# Altium project WB55_board.PrjPcb (part 1 of 3)
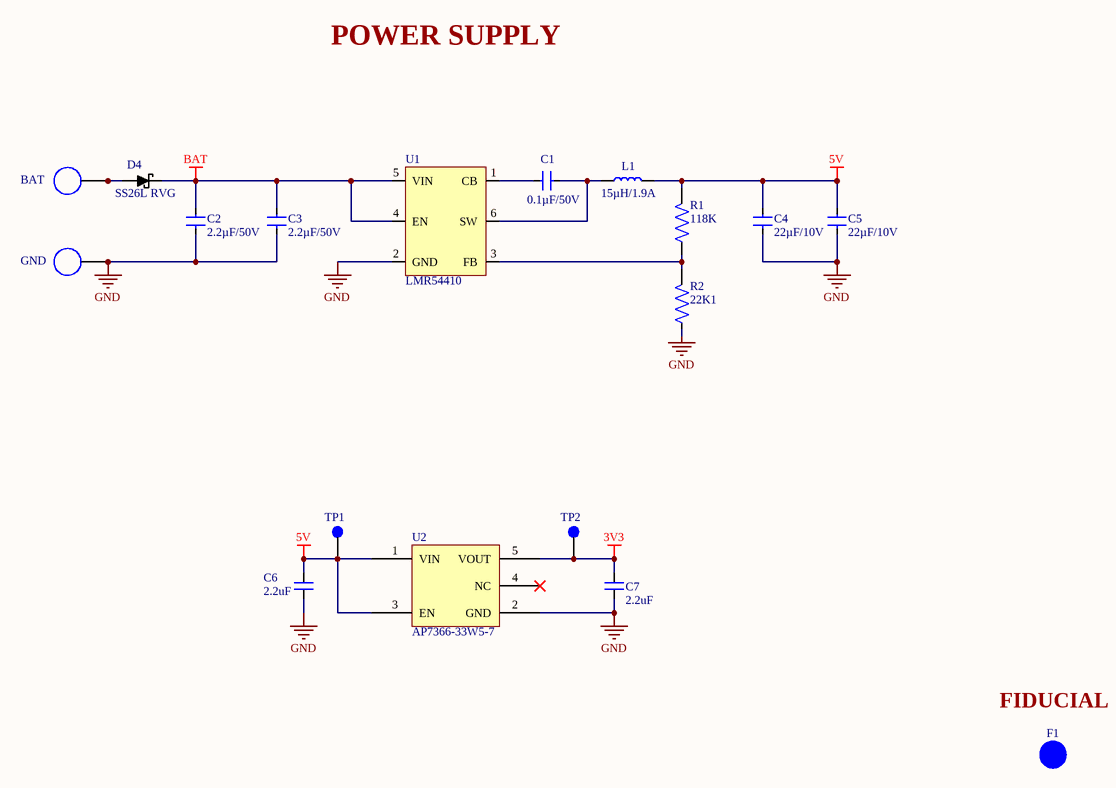
[diagram p0: PowerSupply.SchDoc]
3 sheets, 79 parts. Net scope: flat (ports and power ports of the same name join across sheets).
Board file: PCB1.PcbDoc
Sheets:
  PowerSupply.SchDoc
  MCU.SchDoc
  MCU_IO.SchDoc

## Sheet PowerSupply.SchDoc
size A4; SheetNumber: 1; SheetTotal: 3

### Parts
BAT  Terminal  [2.5mmHOLE]  (value not drawn)  (no BOM)
C1  0.1µF/50V  [C0402]
C2  2.2µF/50V  [C0603]
C3  2.2µF/50V  [C0603]
C4  22µF/10V  [C0603]
C5  22µF/10V  [C0603]
C6  value 2.2uF  [C0603]  (hidden comment: C0603C225K4PACTU)
C7  value 2.2uF  [C0603]  (hidden comment: C0603C225K4PACTU)
D4  SS26L RVG  [SS26LRVG]
F1  FIDUCIAL  [FID_40x120]  (value not drawn)  (no BOM)
GND  Terminal  [2.5mmHOLE]  (value not drawn)  (no BOM)
L1  15µH/1.9A  [SRN6045-150M]
R1  value 118K  [R0402]  (hidden comment: RC0402FR-07118KL)
R2  value 22K1  [R0402]  (hidden comment: RC0402FR-0722K1L)
TP1  TP  [TP]  (value not drawn)  (no BOM)
TP2  TP  [TP]  (value not drawn)  (no BOM)
U1  LMR54410  [LMR54410]
U2  AP7366-33W5-7  [SOT25]

### Nets
3V3: C7.2 TP2.1 U2.5(VOUT)
5V: C4.2 C5.2 C6.2 L1.2 R1.2 TP1.1 U2.1(VIN) U2.3(EN)
BAT: C2.2 C3.2 D4.1(Cathode) U1.4(EN) U1.5(VIN)
GND: C2.1 C3.1 C4.1 C5.1 C6.1 C7.1 GND.1 R2.1 U1.2(GND) U2.2(GND)
NetBAT_1: BAT.1 D4.2(Anode)
NetC1_1: C1.1 U1.1(CB)
NetC1_2: C1.2 L1.1 U1.6(SW)
NetR1_1: R1.1 R2.2 U1.3(FB)

Not connected (* = marked no-connect by the designer): F1 1; U2 4(NC)*

### Notes on the sheet
- POWER SUPPLY
- (near F1) FIDUCIAL

### Library data of the parts
C1 = GRM155R71H104KE14J: MLCC - 0.1µF 50V  0402 X7R ±10%; Manufacturer 1: Murata; Capacitance: 100nF; .PCBChecked: Alex Batista; Supplier 1: Digi-Key; Manufacturer Part Number 1: GRM155R71H104KE14J; Stock 1: 715500; Pricing 1: 1=0.10000, 10=0.03300, 50=0.01780, 100=0.01460, 500=0.01040, 1000=0.00817, 2500=0.00742, 5000=0.00683 (USD); RoHS: Yes; Mount: Surface Mount; Case/Package: 0402; Case Code (Imperial): 0402; Weight: 0.000212oz; Case Code (Metric): 1005; Min Operating Temperature: -55°C; Max Operating Temperature: 125°C; Tolerance: 10%; Dielectric: X7R; Termination: SMD/SMT; Resistor Type: Ceramic; Voltage Rating (DC): 50V; Package Quantity: 50000; Packaging: Tape and Reel; Voltage Rating: 50V; Length: 0.039inch; Width: 0.5mm; Height: 0.5mm; Thickness: 0.022inch; Lead Free: Lead Free; ComponentLink1URL: http://search.murata.co.jp/Ceramy/image/img/A01X/G101/ENG/GRM155R71H104KE14-01.pdf?src-supplier=Mouser; ComponentLink1Description: http://search.murata.co.jp/Ceramy/image/img/A01X/G101/ENG/GRM155R71H104KE14-01.pdf?src-supplier=Mouser; ComponentLink2URL: http://search.murata.co.jp/Ceramy/image/img/A01X/G101/ENG/GRM155R71H104KE14-01.pdf?src-supplier=Avnet; ComponentLink2Description: http://search.murata.co.jp/Ceramy/image/img/A01X/G101/ENG/GRM155R71H104KE14-01.pdf?src-supplier=Avnet; ComponentLink3URL: http://search.murata.co.jp/Ceramy/image/img/A01X/G101/ENG/GRM155R71H104KE14-01.pdf?src-supplier=Digi-Key; ComponentLink3Description: http://search.murata.co.jp/Ceramy/image/img/A01X/G101/ENG/GRM155R71H104KE14-01.pdf?src-supplier=Digi-Key; ComponentLink4URL: http://search.murata.co.jp/Ceramy/image/img/A01X/G101/ENG/GRM155R71H104KE14-01.pdf?src-supplier=Avnet+Europe; ComponentLink4Description: http://search.murata.co.jp/Ceramy/image/img/A01X/G101/ENG/GRM155R71H104KE14-01.pdf?src-supplier=Avnet+Europe; Supplier Part Number 1: 490-13342-1-ND; .SCHChecked: Alex Batista; Manufacturer: Murata; Manufacturer Part Number: GRM155R71H104KE14J
C2 C3 = GRT188R61H225KE13D: MLCC - 2.2µF 50V  0603 X5R ±10%; Manufacturer 1: Murata; Material: 4241ConductorMaterial; Value: 2.2uF; Dielectric: 1537DielectricType; .SCHChecked: Alex Batista; .Mounting: SMT; Supplier: Digikey; Supplier Part Number: 490-12332-1-ND; Manufacturer Part Number 1: GRT188R61H225KE13D; RoHS: Yes; Category: Ceramic Capacitors; Stock: 50026; Pricing: 1=0.19, 10=0.125, 50=0.0788, 100=0.063, 500=0.04552, 1000=0.04027 (USD); Mounting Technology: Surface Mount; Case/Package: 0603; Case Code (Metric): 1608; Case Code (Imperial): 0603; Min Operating Temperature: -55°C; Max Operating Temperature: 85°C; Packaging: Cut Tape; Voltage Rating: 50V; Tolerance: 10%; Series: GRT; Voltage Rating (DC): 50V; Length: 0.063inch; Width: 0.031inch; Height: 1mm; Thickness: 0.035inch; Ratings: AEC-Q200; RoHS Compliant: Yes; ComponentLink1URL: http://www.farnell.com/datasheets/2165960.pdf?src-supplier=Farnell; ComponentLink1Description: http://www.farnell.com/datasheets/2165960.pdf?src-supplier=Farnell; ComponentLink2URL: https://datasheet.octopart.com/GRT188R61H225KE13D-Murata-datasheet-149523597.pdf?src-supplier=Farnell; ComponentLink2Description: https://datasheet.octopart.com/GRT188R61H225KE13D-Murata-datasheet-149523597.pdf?src-supplier=Farnell; ComponentLink3URL: https://datasheet.octopart.com/GRT188R61H225KE13D-Murata-datasheet-67697752.pdf?src-supplier=Element14; ComponentLink3Description: https://datasheet.octopart.com/GRT188R61H225KE13D-Murata-datasheet-67697752.pdf?src-supplier=Element14; ComponentLink4URL: https://search.murata.co.jp/Ceramy/image/img/A01X/G101/ENG/GRT188R61H225KE13-01.pdf?src-supplier=Digikey; ComponentLink4Description: https://search.murata.co.jp/Ceramy/image/img/A01X/G101/ENG/GRT188R61H225KE13-01.pdf?src-supplier=Digikey; ComponentLink5URL: http://search.murata.co.jp/Ceramy/image/img/A01X/G101/ENG/GRT188R61H225KE13-01.pdf?src-supplier=Digikey; ComponentLink5Description: http://search.murata.co.jp/Ceramy/image/img/A01X/G101/ENG/GRT188R61H225KE13-01.pdf?src-supplier=Digikey; ComponentLink6URL: https://datasheet.octopart.com/GRT188R61H225KE13D-Murata-datasheet-165579666.pdf?src-supplier=TME; ComponentLink6Description: https://datasheet.octopart.com/GRT188R61H225KE13D-Murata-datasheet-165579666.pdf?src-supplier=TME; .PCBChecked: Alex Batista; Manufacturer: Murata; Manufacturer Part Number: GRT188R61H225KE13D
C4 C5 = CL10A226MP8NUNE: MLCC - 22µF 10V 0603 X5R ±20%; Manufacturer 1: Samsung; Dielectric Material: Ceramic; Value: 22uF; Multilayer: Yes; .SCHChecked: Alex Batista; .Mounting: SMT; Supplier 1: Digikey; Manufacturer Part Number 1: CL10A226MP8NUNE; RoHS: Yes; Category: Ceramic Capacitors; Stock 1: 4041118; Pricing 1: 1=0,13, 10=0,074, 100=0,0471, 1000=0,03264 (USD); Mounting Technology: Surface Mount; Pins: 2; Package Shape: Rectangular; Case/Package: 0603; Terminal Finish: Nickel; Min Operating Temperature: -55°C; Max Operating Temperature: 85°C; JESD-609 Code: e3; Capacitor Type: Ceramic; Tolerance  (fill in as +-): 20%; Package Style: SMTMeter; Packaging: Tape and Reel; Tolerance (fill in as +-): 20%; Rated DC Voltage (URdc): 10V; Temperature Characteristics Code: X5R; Termination: Wraparound; Length: 1.6mm; Width: 0.8mm; Height: 1.05mm; Reach SVHC Compliant: Yes; RoHS Compliant: Yes; ComponentLink1URL: https://datasheet.ciiva.com:443/pdfs/VipMasterIC/IC/SEMS/SEMS-S-A0008525088/SEMS-S-A0008525102-1.pdf?src-supplier=IHS+Markit; ComponentLink1Description: https://datasheet.ciiva.com:443/pdfs/VipMasterIC/IC/SEMS/SEMS-S-A0008525088/SEMS-S-A0008525102-1.pdf?src-supplier=IHS+Markit; ComponentLink2URL: https://datasheet.ciiva.com/25711/cl10a226mp8nune-25711532.pdf?src-supplier=Digikey; ComponentLink2Description: https://datasheet.ciiva.com/25711/cl10a226mp8nune-25711532.pdf?src-supplier=Digikey; ComponentLink3URL: https://datasheet.ciiva.com/26838/getdatasheetpartid-746477-26838370.pdf?src-supplier=Verical; ComponentLink3Description: https://datasheet.ciiva.com/26838/getdatasheetpartid-746477-26838370.pdf?src-supplier=Verical; Supplier Part Number 1: 1276-1274-1-ND; .PCBChecked: Alex Batista; Manufacturer: Samsung; Manufacturer Part Number: CL10A226MP8NUNE
C6 C7 = C0603C225K4PACTU: Ceramic Capacitor, Multilayer, Ceramic, 16V, 10% +Tol, 10% -Tol, X5R, 15% TC, 2.2uF, Surface Mount, 0603; Manufacturer: KEMET; Dissipation Factor: 5%; Supplier: Mouser; Supplier Part Number: 80-C0603C225K4P; Manufacturer Part Number: C0603C225K4PACTU; RoHS: Yes; Category: Ceramic Capacitors; Stock: 124238; Pricing: 1=0,12, 10=0,059, 50=0,059, 100=0,039, 1000=0,027, 10000=0,017 (USD); Mounting Technology: Surface Mount; Case/Package: 0603; Pins: 2; Case Code (Imperial): 0603; Case Code (Metric): 1608; Dielectric Material: Ceramic; Material: Ceramic; Min Operating Temperature: -55°C; Max Operating Temperature: 85°C; Tolerance: 10%; Voltage Rating: 16V; Voltage Rating (DC): 16V; Packaging: Tape and Reel; Package Quantity: 1; Dielectric: X5R; Termination: SMD/SMT; Voltage: 16V; Series: C; Construction: Flat; Length: 1.6mm; Width: 0.031inch; Height: 0.8mm; Thickness: 0.034inch; Depth: 0.8mm; Radiation Hardening: No; Reach SVHC Compliant: No; RoHS Compliant: Yes; Lead Free: 5697LeadFree; ComponentLink1URL: https://datasheet.ciiva.com/5969/1776083-5969304.pdf?src-supplier=Farnell; ComponentLink1Description: https://datasheet.ciiva.com/5969/1776083-5969304.pdf?src-supplier=Farnell; ComponentLink2URL: https://datasheet.ciiva.com/7823/1776083-7823706.pdf?src-supplier=Element14; ComponentLink2Description: https://datasheet.ciiva.com/7823/1776083-7823706.pdf?src-supplier=Element14
D4 = SS26L RVG: DIODE - Schottky 60V 2A 2-Pin Sub SMA T/R; Manufacturer 1: Taiwan Semiconductor; .SCHChecked: Alex Batista; .Mouting: SMT; Supplier: Digi-Key; Supplier Part Number: SS26LRVGCT-ND; Manufacturer Part Number 1: SS26L RVG; RoHS: Yes; Stock: 38; Pricing: 1=0.66, 10=0.578 (USD); RoHS Compliant: Yes; .PCBChecked: Alex Batista; Manufacturer: Taiwan Semiconductor; Manufacturer Part Number: SS26L RVG
L1 = SRN6045-150M: IND - 15µH Semi-Shielded 1.9 A 95.8mOhm; Manufacturer 1: Bourns; Core Material: Ferrite; Inductance Tolerance: 20%; Current Rating: 1.9A; Saturation Current: 2.3A; Value: 15uH; DC Resistance (DCR): 95.8mR; Self Resonant Frequency: 13MHz; Test Frequency: 100kHz; .SCHChecked: Alex Batista; .Mouting: SMT; Supplier: Digi-Key; Supplier Part Number: SRN6045-150MCT-ND; Manufacturer Part Number 1: SRN6045-150M; RoHS: Yes; Category: Fixed Inductors; Stock: 65513; Pricing: 1=0.57, 10=0.499, 25=0.464, 50=0.3924, 100=0.3568, 250=0.33536, 500=0.2997 (USD); Mounting Technology: Surface Mount; Case/Package: Nonstandard; Pins: 2; Weight: 0.027725oz; Min Operating Temperature: -40°C; Max Operating Temperature: 125°C; Tolerance: 20%; Packaging: Tape and Reel; Shielding: Shielded; Package Quantity: 1000; Max DC Current: 1.9A; Termination: SMD/SMT; RMS Current (Irms): 1.9A; Series: SRN6045; Length: 6mm; Width: 6mm; Height: 4.5mm; Height - Seated (Max): 0.177inch; Depth: 6mm; Reach SVHC Compliant: No; RoHS Compliant: Yes; ComponentLink1URL: https://datasheet.ciiva.com/5986/1705518-5986195.pdf?src-supplier=Farnell; ComponentLink1Description: https://datasheet.ciiva.com/5986/1705518-5986195.pdf?src-supplier=Farnell; ComponentLink2URL: https://datasheet.ciiva.com/11802/0900766b80fe1f3e-11802573.pdf?src-supplier=Rs; ComponentLink2Description: https://datasheet.ciiva.com/11802/0900766b80fe1f3e-11802573.pdf?src-supplier=Rs; ComponentLink3URL: https://datasheet.ciiva.com/4954/srn6045-70649-4954231.pdf?src-supplier=Mouser; ComponentLink3Description: https://datasheet.ciiva.com/4954/srn6045-70649-4954231.pdf?src-supplier=Mouser; ComponentLink4URL: https://datasheet.ciiva.com/8512/srn6045-8512989.pdf?src-supplier=Avnet; ComponentLink4Description: https://datasheet.ciiva.com/8512/srn6045-8512989.pdf?src-supplier=Avnet; ComponentLink5URL: https://datasheet.ciiva.com/1056/srn6045-1056106.pdf?src-supplier=Digi-Key; ComponentLink5Description: https://datasheet.ciiva.com/1056/srn6045-1056106.pdf?src-supplier=Digi-Key; ComponentLink6URL: https://datasheet.ciiva.com/1056/srn6045-1056107.pdf?src-supplier=Digi-Key; ComponentLink6Description: https://datasheet.ciiva.com/1056/srn6045-1056107.pdf?src-supplier=Digi-Key; ComponentLink7URL: https://datasheet.ciiva.com/1056/srn6045-1056108.pdf?src-supplier=Digi-Key; ComponentLink7Description: https://datasheet.ciiva.com/1056/srn6045-1056108.pdf?src-supplier=Digi-Key; ComponentLink8URL: https://datasheet.ciiva.com/17113/70231653-17113165.pdf?src-supplier=Allied+Electronics; ComponentLink8Description: https://datasheet.ciiva.com/17113/70231653-17113165.pdf?src-supplier=Allied+Electronics; .PCBChecked: Alex Batista; Manufacturer: Bourns; Manufacturer Part Number: SRN6045-150M
R1 = RC0402FR-07118KL: RES - 118K 1/16W 0402 ±1%; Manufacturer 1: Yageo; Power Rating: 62.5mW; Voltage Rating: 50V; Temperature Coefficient: 100ppm/°C; Max Power Dissipation: 63mW; .SCHChecked: Alex Batista; .Mouting: SMT; Supplier: Digi-Key; Supplier Part Number: YAG2369CT-ND; Manufacturer Part Number 1: RC0402FR-07118KL; RoHS: Yes; Category: Chip SMD Resistors; Stock: 556112; Pricing: 1=0.1, 10=0.014, 50=0.0084, 100=0.007, 500=0.00464, 1000=0.00396, 5000=0.00282 (USD); Case/Package: 0402; Case Code (Metric): 1005; Case Code (Imperial): 0402; Contact Plating: Tin,Matte; Min Operating Temperature: -55°C; Max Operating Temperature: 155°C; Tolerance: 1%; Packaging: Tape and Reel; Package Quantity: 10000; Number of Terminations: 2; Termination: SMD/SMT; Voltage Rating (DC): 50V; Features: Moisture Resistant; Series: RC; Construction: Rectangular; Length: 1mm; Width: 0.5mm; Height: 0.016inch; Depth: 0.5mm; Military Standard: Not; Lead Free: Lead Free; RoHS Compliant: Yes; ComponentLink1URL: https://datasheet.ciiva.com/8887/pyu-rc0402-51-rohs-l-6-8887658.pdf?src-supplier=Avnet; ComponentLink1Description: https://datasheet.ciiva.com/8887/pyu-rc0402-51-rohs-l-6-8887658.pdf?src-supplier=Avnet; ComponentLink2URL: https://datasheet.ciiva.com/12558/pyu-rc0402-51-rohs-l-6-r-8721-12558524.pdf?src-supplier=Mouser; ComponentLink2Description: https://datasheet.ciiva.com/12558/pyu-rc0402-51-rohs-l-6-r-8721-12558524.pdf?src-supplier=Mouser; ComponentLink3URL: https://datasheet.ciiva.com/2552/pyu-r-int-thick-7-2552967.pdf?src-supplier=Digi-Key; ComponentLink3Description: https://datasheet.ciiva.com/2552/pyu-r-int-thick-7-2552967.pdf?src-supplier=Digi-Key; ComponentLink4URL: https://datasheet.ciiva.com/26829/getdatasheetpartid-702380-26829882.pdf?src-supplier=Verical; ComponentLink4Description: https://datasheet.ciiva.com/26829/getdatasheetpartid-702380-26829882.pdf?src-supplier=Verical; .PCBChecked: Alex Batista; Manufacturer: Yageo; Manufacturer Part Number: RC0402FR-07118KL
R2 = RC0402FR-0722K1L: RES - 22K1 1/16W 0402 ±1%; Manufacturer 1: Yageo; Power Rating: 62.5mW; Voltage Rating: 50V; Max Power Dissipation: 63mW; Temperature Coefficient: 100ppm/°C; .PCBChecked: Alex Batista; .Mouting: SMT; Supplier: Digi-Key; Supplier Part Number: 311-22.1KLRCT-ND; Manufacturer Part Number 1: RC0402FR-0722K1L; RoHS: Yes; Category: Chip SMD Resistors; Stock: 435944; Pricing: 1=0.1, 10=0.014, 50=0.0084, 100=0.007, 500=0.00464, 1000=0.00396, 5000=0.00282 (USD); Case/Package: 0402; Case Code (Metric): 1005; Case Code (Imperial): 0402; Min Operating Temperature: -55°C; Max Operating Temperature: 155°C; Package Quantity: 1; Tolerance: 1%; Packaging: Tape and Reel; Resistor Type: Thick Film; Number of Terminations: 2; Termination: SMD/SMT; Voltage Rating (DC): 50V; Working Voltage: 50V; Features: Moisture Resistant; Series: RC; Technology: THICK FILM; Resistance Tolerance: 1%; Construction: Rectangular; Length: 0.039inch; Width: 0.02inch; Height: 0.016inch; Depth: 0.5mm; Reach SVHC Compliant: No; Military Standard: Not; Lead Free: Lead Free; RoHS Compliant: Yes; ComponentLink1URL: https://datasheet.ciiva.com/2553/pyu-r-int-thick-7-2553200.pdf?src-supplier=Digi-Key; ComponentLink1Description: https://datasheet.ciiva.com/2553/pyu-r-int-thick-7-2553200.pdf?src-supplier=Digi-Key; ComponentLink2URL: https://datasheet.ciiva.com/2553/pyu-r-int-thick-7-2553201.pdf?src-supplier=Digi-Key; ComponentLink2Description: https://datasheet.ciiva.com/2553/pyu-r-int-thick-7-2553201.pdf?src-supplier=Digi-Key; ComponentLink3URL: https://datasheet.ciiva.com/2553/pyu-r-int-thick-7-2553202.pdf?src-supplier=Digi-Key; ComponentLink3Description: https://datasheet.ciiva.com/2553/pyu-r-int-thick-7-2553202.pdf?src-supplier=Digi-Key; .SCHChecked: Alex Batista; Manufacturer: Yageo; Manufacturer Part Number: RC0402FR-0722K1L
TP1 TP2 = TP: Test Point
U1 = LMR54410DBVR: IC - DC/DC BUCK, Current-mode, 1A, 1100kHz SOT32-6; Manufacturer 1: Texas Instruments; .SCHChecked: Alex Batista; .Mouting: SMT; Supplier: Digi-Key; Supplier Part Number: 296-LMR54410DBVRCT-ND; Manufacturer Part Number 1: LMR54410DBVR; RoHS: No; Category: Voltage Regulators - Switching; Stock: 13950; Pricing: 1=1.07, 10=0.959, 25=0.9108, 100=0.748, 250=0.69924, 500=0.61792, 1000=0.48783 (USD); .PCBChecked: Alex Batista; Manufacturer: Texas Instruments; Manufacturer Part Number: LMR54410DBVR
U2 = AP7366-33W5-7: Ldo, Fixed, 3.3V, 0.6A, -40 To 85Deg C Rohs Compliant: Yes |Diodes Inc. AP7366-33W5-7; Manufacturer: Diodes; Number of Channels: 1NUMBER; Supplier: Future Electronics; Supplier Part Number: 8130059; Manufacturer Part Number: AP7366-33W5-7; RoHS: Yes; Stock: 9000; Pricing: 3000=0,0633, 9000=0,0609, 15000=0,0598, 30000=0,0584, 60000=0,0561 (USD); Output Voltage: 3.3V; ComponentLink1URL: https://datasheet.octopart.com/AP7366-33W5-7-Diodes-Inc.-datasheet-147761854.pdf?src-supplier=Farnell; ComponentLink1Description: https://datasheet.octopart.com/AP7366-33W5-7-Diodes-Inc.-datasheet-147761854.pdf?src-supplier=Farnell; ComponentLink2URL: https://www.diodes.com/assets/Datasheets/AP7366.pdf?src-supplier=Digikey; ComponentLink2Description: https://www.diodes.com/assets/Datasheets/AP7366.pdf?src-supplier=Digikey